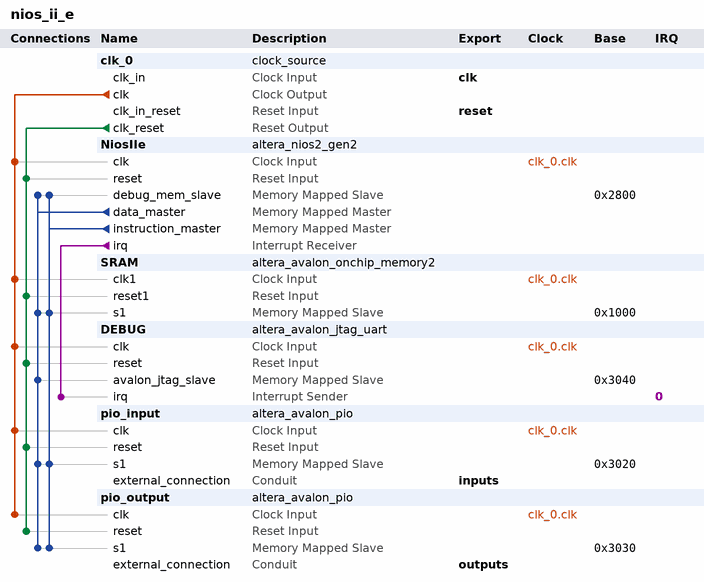
[diagram p0: system contents]
# Platform Designer (Qsys) system nios_ii_e, MAX 10 10M08DAF256C8GES
# Parameters at their usual value, and those the tool derives, are not listed.
package require -exact qsys 22.1
create_system nios_ii_e
set_project_property DEVICE_FAMILY {MAX 10}
set_project_property DEVICE 10M08DAF256C8GES

add_instance clk_0 clock_source 22.1
set_instance_parameter_value clk_0 clockFrequency 50000000

add_instance NiosIIe altera_nios2_gen2 22.1
set_instance_parameter_value NiosIIe dcache_size 2048
set_instance_parameter_value NiosIIe exceptionSlave SRAM.s1
set_instance_parameter_value NiosIIe icache_size 4096
set_instance_parameter_value NiosIIe impl Tiny
set_instance_parameter_value NiosIIe resetSlave SRAM.s1

add_instance SRAM altera_avalon_onchip_memory2 22.1
set_instance_parameter_value SRAM dataWidth 32
set_instance_parameter_value SRAM dualPort false
set_instance_parameter_value SRAM initMemContent true
set_instance_parameter_value SRAM initializationFileName onchip_mem.hex
set_instance_parameter_value SRAM memorySize 4096

add_instance DEBUG altera_avalon_jtag_uart 22.1
set_instance_parameter_value DEBUG simInteractiveOptions NO_INTERACTIVE_WINDOWS

add_instance pio_input altera_avalon_pio 22.1
set_instance_parameter_value pio_input direction Input
set_instance_parameter_value pio_input width 8

add_instance pio_output altera_avalon_pio 22.1
set_instance_parameter_value pio_output direction Output
set_instance_parameter_value pio_output width 8

# connections
add_connection clk_0.clk DEBUG.clk clock
add_connection clk_0.clk NiosIIe.clk clock
add_connection clk_0.clk pio_input.clk clock
add_connection clk_0.clk pio_output.clk clock
add_connection clk_0.clk SRAM.clk1 clock
add_connection clk_0.clk_reset DEBUG.reset reset
add_connection clk_0.clk_reset NiosIIe.reset reset
add_connection clk_0.clk_reset pio_input.reset reset
add_connection clk_0.clk_reset pio_output.reset reset
add_connection clk_0.clk_reset SRAM.reset1 reset
add_connection NiosIIe.data_master DEBUG.avalon_jtag_slave avalon
set_connection_parameter_value NiosIIe.data_master/DEBUG.avalon_jtag_slave baseAddress 0x3040
add_connection NiosIIe.data_master NiosIIe.debug_mem_slave avalon
set_connection_parameter_value NiosIIe.data_master/NiosIIe.debug_mem_slave baseAddress 0x2800
add_connection NiosIIe.data_master pio_input.s1 avalon
set_connection_parameter_value NiosIIe.data_master/pio_input.s1 baseAddress 0x3020
add_connection NiosIIe.data_master pio_output.s1 avalon
set_connection_parameter_value NiosIIe.data_master/pio_output.s1 baseAddress 0x3030
add_connection NiosIIe.data_master SRAM.s1 avalon
set_connection_parameter_value NiosIIe.data_master/SRAM.s1 baseAddress 0x1000
add_connection NiosIIe.instruction_master NiosIIe.debug_mem_slave avalon
set_connection_parameter_value NiosIIe.instruction_master/NiosIIe.debug_mem_slave baseAddress 0x2800
add_connection NiosIIe.instruction_master pio_input.s1 avalon
set_connection_parameter_value NiosIIe.instruction_master/pio_input.s1 baseAddress 0x3020
add_connection NiosIIe.instruction_master pio_output.s1 avalon
set_connection_parameter_value NiosIIe.instruction_master/pio_output.s1 baseAddress 0x3030
add_connection NiosIIe.instruction_master SRAM.s1 avalon
set_connection_parameter_value NiosIIe.instruction_master/SRAM.s1 baseAddress 0x1000
add_connection NiosIIe.irq DEBUG.irq interrupt
set_connection_parameter_value NiosIIe.irq/DEBUG.irq irqNumber 0

# exported interfaces
add_interface clk clock sink
set_interface_property clk EXPORT_OF clk_0.clk_in
add_interface inputs conduit end
set_interface_property inputs EXPORT_OF pio_input.external_connection
add_interface outputs conduit end
set_interface_property outputs EXPORT_OF pio_output.external_connection
add_interface reset reset sink
set_interface_property reset EXPORT_OF clk_0.clk_in_reset

set_interconnect_requirement {$system} qsys_mm.clockCrossingAdapter HANDSHAKE
set_interconnect_requirement {$system} qsys_mm.enableEccProtection FALSE
set_interconnect_requirement {$system} qsys_mm.insertDefaultSlave FALSE
set_interconnect_requirement {$system} qsys_mm.maxAdditionalLatency 1

save_system nios_ii_e.qsys
